# EAGLE schematic final (EAGLE 9.2.0)
eve
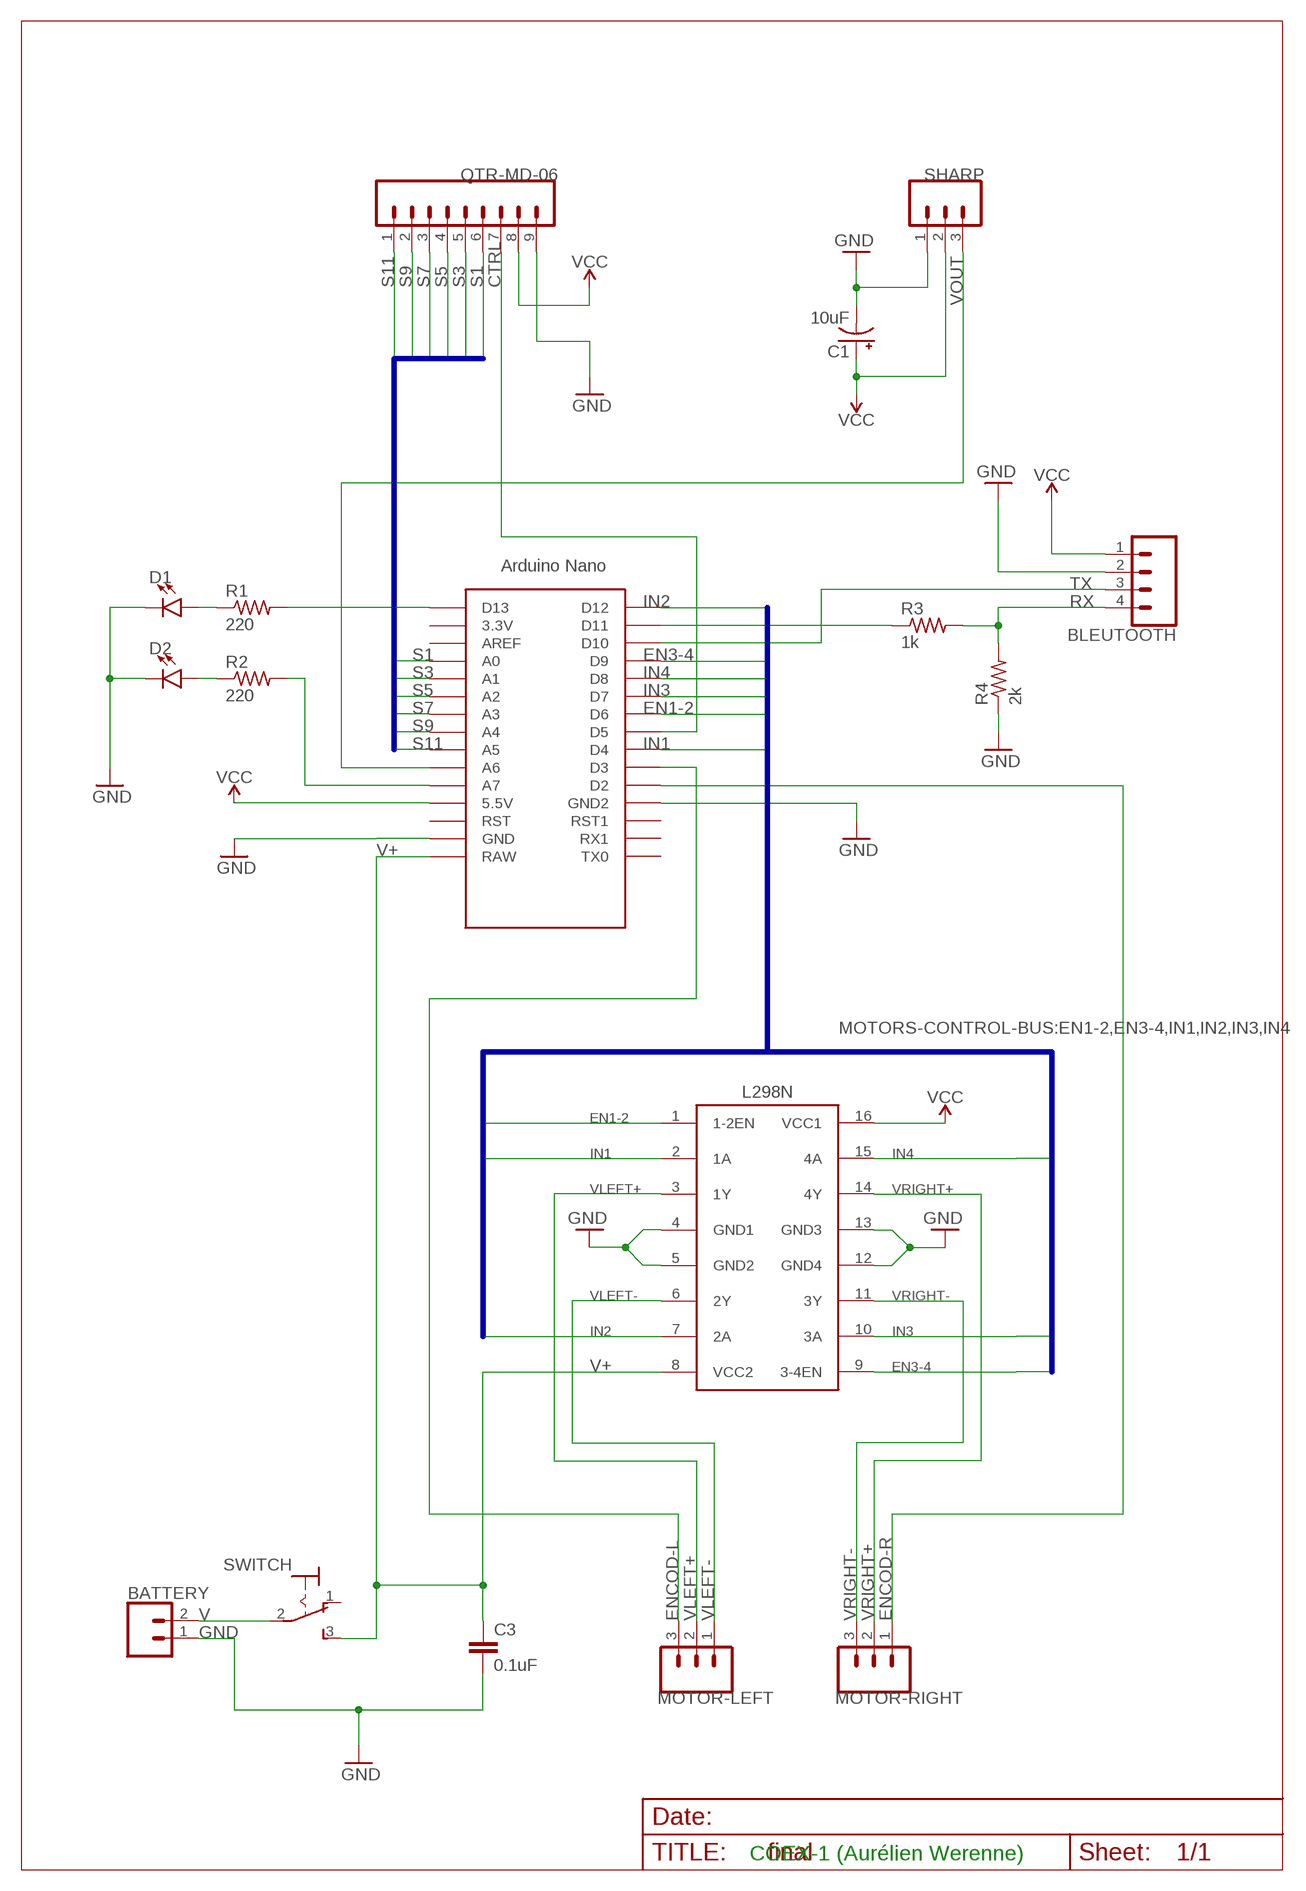
[diagram p0: schematic, sheet 1]

## Parts
BATTERY  CONN_02  [1X02]
BLEUTOOTH  CONN_04  [1X04]
C1  10uF  10UF-POLAR-RADIAL-2.5MM-25V-20%  [CPOL-RADIAL-2.5MM-5MM]
C3  0.1uF  0.1UF-KIT-EZ-50V-20%  [CAP-PTH-SMALL-KIT]
D1  LED3MM  [LED_3MM]
D2  LED3MM  [LED_3MM]
L298N  L293D  [DIL16]
MOTOR-LEFT  CONN_03  [1X03]
MOTOR-RIGHT  CONN_03  [1X03]
QTR-MD-06  CONN_09  [1X09]
R1  220  R-US_0207/12  [0207/12]
R2  220  R-US_0207/12  [0207/12]
R3  1k  R-US_0207/12  [0207/12]
R4  2k  R-US_0207/12  [0207/12]
SHARP  CONN_03  [1X03]
SWITCH  320-916  [320-916]
U$1  NANO  [NANO]

## Nets
CTRL: QTR-MD-06.7 U$1.D5
EN1-2: L298N.1(1-2EN) U$1.D6
EN3-4: L298N.9(3-4EN) U$1.D9
ENCOD-L: MOTOR-LEFT.3 U$1.D3
ENCOD-R: MOTOR-RIGHT.1 U$1.D2
GND: BATTERY.1 BLEUTOOTH.2 C1.2(-) C3.2 D1.K(C) D2.K(C) L298N.4(GND1) L298N.5(GND2) L298N.12(GND4) L298N.13(GND3) QTR-MD-06.9 R4.1 SHARP.1 U$1.GND U$1.GND1(GND2)
IN1: L298N.2(1A) U$1.D4
IN2: L298N.7(2A) U$1.D12
IN3: L298N.10(3A) U$1.D7
IN4: L298N.15(4A) U$1.D8
N$1: R2.2 U$1.A7
N$2: R1.2 U$1.D13
N$3: D1.A R1.1
N$4: D2.A R2.1
N$5: R3.1 U$1.D11
RX: BLEUTOOTH.4 R3.2 R4.2
S1: QTR-MD-06.6 U$1.A0
S3: QTR-MD-06.5 U$1.A1
S5: QTR-MD-06.4 U$1.A2
S7: QTR-MD-06.3 U$1.A3
S9: QTR-MD-06.2 U$1.A4
S11: QTR-MD-06.1 U$1.A5
TX: BLEUTOOTH.3 U$1.D10
V: BATTERY.2 SWITCH.2(P)
V+: C3.1 L298N.8(VCC2) SWITCH.3(S) U$1.RAW
VCC: BLEUTOOTH.1 C1.1(+) L298N.16(VCC1) QTR-MD-06.8 SHARP.2 U$1.5V(5.5V)
VLEFT+: L298N.3(1Y) MOTOR-LEFT.2
VLEFT-: L298N.6(2Y) MOTOR-LEFT.1
VOUT: SHARP.3 U$1.A6
VRIGHT+: L298N.14(4Y) MOTOR-RIGHT.2
VRIGHT-: L298N.11(3Y) MOTOR-RIGHT.3
Unconnected: SWITCH.1(O) U$1.3.3V U$1.AREF U$1.ICSP1 U$1.ICSP2 U$1.ICSP3 U$1.ICSP4 U$1.ICSP5 U$1.ICSP6 U$1.RST U$1.RST1 U$1.RX1 U$1.TX0

## Buses
MOTORS-CONTROL-BUS:EN1-2,EN3-4,IN1,IN2,IN3,IN4
QTR-BUS:S1,S3,S5,S7,S9,S11

## Notes on the sheet
- COEX-1 (Aurélien Werenne)

## Library data of the parts
BATTERY = SparkFun-Connectors:CONN_02: Multi connection point. Often used as Generic Header-pin footprint for 0.1 inch spaced/style header connections On any of the 0.1 inch spaced packages, you can populate with these: Break Away Headers - Straight <https://www.sparkfun.com/products/116> (PRT-00116) Break Away Male Headers - Right Angle <https://www.sparkfun.com/products/553> (PRT-00553) Female Headers <https://www.sparkfun.com/products/115> (PRT-00115) Break Away Headers - Machine Pin <https://www.sparkfun.com/products/117> (PRT-00117) Break Away Female Headers - Swiss Machine Pin <https://www.sparkfun.com/products/743> (PRT-00743) For SCREWTERMINALS and SPRING TERMINALS visit here: Screw Terimnals on SparkFun.com <https://www.sparkfun.com/search/results?term=Screw+Terminals> (5mm/3.5mm/2.54mm spacing) This device is also useful as a general connection point to wire up your design to another part of your project. Our various solder wires solder well into these plated through hole pads. Hook-Up Wire - Assortment (Stranded, 22 AWG) <https://www.sparkfun.com/products/11375> (PRT-11375) Hook-Up Wire - Assortment (Solid Core, 22 AWG) <https://www.sparkfun.com/products/11367> (PRT-11367) View the entire wire category on our website here <https://www.sparkfun.com/categories/141> Special notes: Molex polarized connector foot print use with: PRT-08233 with associated crimp pins and housings. 2.54_SCREWTERM for use with PRT-10571. 3.5mm Screw Terminal footprints for PRT-08084 5mm Screw Terminal footprints for use with PRT-08432
BLEUTOOTH = SparkFun-Connectors:CONN_04: Multi connection point. Often used as Generic Header-pin footprint for 0.1 inch spaced/style header connections On any of the 0.1 inch spaced packages, you can populate with these: Break Away Headers - Straight <https://www.sparkfun.com/products/116> (PRT-00116) Break Away Male Headers - Right Angle <https://www.sparkfun.com/products/553> (PRT-00553) Female Headers <https://www.sparkfun.com/products/115> (PRT-00115) Break Away Headers - Machine Pin <https://www.sparkfun.com/products/117> (PRT-00117) Break Away Female Headers - Swiss Machine Pin <https://www.sparkfun.com/products/743> (PRT-00743) For SCREWTERMINALS and SPRING TERMINALS visit here: Screw Terimnals on SparkFun.com <https://www.sparkfun.com/search/results?term=Screw+Terminals> (5mm/3.5mm/2.54mm spacing) This device is also useful as a general connection point to wire up your design to another part of your project. Our various solder wires solder well into these plated through hole pads. Hook-Up Wire - Assortment (Stranded, 22 AWG) <https://www.sparkfun.com/products/11375> (PRT-11375) Hook-Up Wire - Assortment (Solid Core, 22 AWG) <https://www.sparkfun.com/products/11367> (PRT-11367) View the entire wire category on our website here <https://www.sparkfun.com/categories/141> Special notes: Molex polarized connector foot print use with SKU : PRT-08231 with associated crimp pins and housings. 1MM SMD Version SKU: PRT-10208; PROD_ID: CONN-09696
C1 = SparkFun-Capacitors:10UF-POLAR: 10.0µF polarized capacitors A capacitor is a passive two-terminal electrical component used to store electrical energy temporarily in an electric field.; PROD_ID: CAP-08440
C3 = SparkFun-Capacitors:0.1UF: 0.1µF ceramic capacitors A capacitor is a passive two-terminal electrical component used to store electrical energy temporarily in an electric field.; PROD_ID: CAP-08370
D1 D2 = SparkFun-LED:LED: LED (Generic) Standard schematic elements and footprints for 5mm, 3mm, 1206, and 0603 sized LEDs. Generic LEDs with no color specified.; PROD_ID: DIO-08794
L298N = st-microelectronics:L293D: PUSH-PULL 4 CHANNEL DRIVER; MPN: L293D; OC_FARNELL: 9589619; OC_NEWARK: 56P8249
MOTOR-LEFT MOTOR-RIGHT SHARP = SparkFun-Connectors:CONN_03: Multi connection point. Often used as Generic Header-pin footprint for 0.1 inch spaced/style header connections On any of the 0.1 inch spaced packages, you can populate with these: Break Away Headers - Straight <https://www.sparkfun.com/products/116> (PRT-00116) Break Away Male Headers - Right Angle <https://www.sparkfun.com/products/553> (PRT-00553) Female Headers <https://www.sparkfun.com/products/115> (PRT-00115) Break Away Headers - Machine Pin <https://www.sparkfun.com/products/117> (PRT-00117) Break Away Female Headers - Swiss Machine Pin <https://www.sparkfun.com/products/743> (PRT-00743) Stackable Header - 3 Pin (Female, 0.1") <https://www.sparkfun.com/products/13875> (PRT-13875) For SCREWTERMINALS and SPRING TERMINALS visit here: Screw Terimnals on SparkFun.com <https://www.sparkfun.com/search/results?term=Screw+Terminals> (5mm/3.5mm/2.54mm spacing) This device is also useful as a general connection point to wire up your design to another part of your project. Our various solder wires solder well into these plated through hole pads. Hook-Up Wire - Assortment (Stranded, 22 AWG) <https://www.sparkfun.com/products/11375> (PRT-11375) Hook-Up Wire - Assortment (Solid Core, 22 AWG) <https://www.sparkfun.com/products/11367> (PRT-11367) View the entire wire category on our website here <https://www.sparkfun.com/categories/141> Special notes: Molex polarized connector foot print use with SKU : PRT-08232 with associated crimp pins and housings.
QTR-MD-06 = SparkFun-Connectors:CONN_09: Multi connection point. Often used as Generic Header-pin footprint for 0.1 inch spaced/style header connections On any of the 0.1 inch spaced packages, you can populate with these: Break Away Headers - Straight <https://www.sparkfun.com/products/116> (PRT-00116) Break Away Male Headers - Right Angle <https://www.sparkfun.com/products/553> (PRT-00553) Female Headers <https://www.sparkfun.com/products/115> (PRT-00115) Break Away Headers - Machine Pin <https://www.sparkfun.com/products/117> (PRT-00117) Break Away Female Headers - Swiss Machine Pin <https://www.sparkfun.com/products/743> (PRT-00743) For SCREWTERMINALS and SPRING TERMINALS visit here: Screw Terimnals on SparkFun.com <https://www.sparkfun.com/search/results?term=Screw+Terminals> (5mm/3.5mm/2.54mm spacing) This device is also useful as a general connection point to wire up your design to another part of your project. Our various solder wires solder well into these plated through hole pads. Hook-Up Wire - Assortment (Stranded, 22 AWG) <https://www.sparkfun.com/products/11375> (PRT-11375) Hook-Up Wire - Assortment (Solid Core, 22 AWG) <https://www.sparkfun.com/products/11367> (PRT-11367) View the entire wire category on our website here <https://www.sparkfun.com/categories/141> Special notes: Molex polarized connector foot print use with SKU : PRT-08231 with associated crimp pins and housings. 1MM SMD Version SKU: PRT-10208 NOTES ON THE VARIANTS LOCK and LOCK_LONGPADS... This footprint was designed to help hold the alignment of a through-hole component (i.e. 6-pin header) while soldering it into place. You may notice that each hole has been shifted either up or down by 0.005 of an inch from it's more standard position (which is a perfectly straight line). This slight alteration caused the pins (the squares in the middle) to touch the edges of the holes. Because they are alternating, it causes a "brace" to hold the component in place. 0.005 has proven to be the perfect amount of "off-center" position when using our standard breakaway headers. Although looks a little odd when you look at the bare footprint, once you have a header in there, the alteration is very hard to notice. Also,if you push a header all the way into place, it is covered up entirely on the bottom side.
R1-R4 = resistor:R-US_: RESISTOR, American symbol
SWITCH = switch:320-916: TOGGLE SWITCH distributor RS Components
U$1 = Arduino-clone:NANO: Arduino Nano